# Altium schematic sheet WIFI.SchDoc
size A4
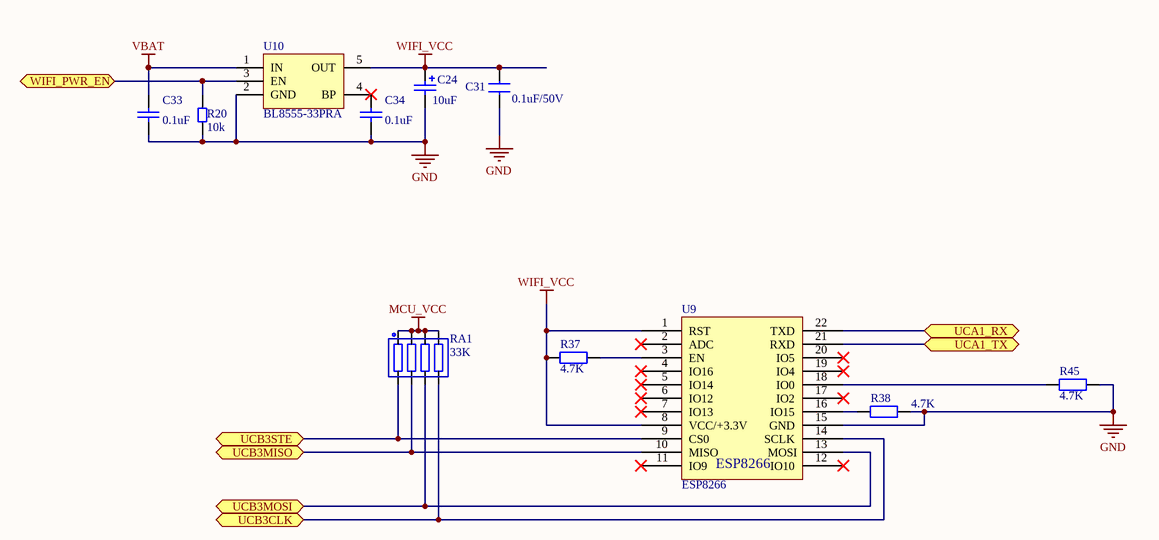
[diagram p0: WIFI.SchDoc]

## Parts
C24  10uF  [CAP1210]
C31  0.1uF/50V  [0603C]
C33  0.1uF  [0603C]
C34  0.1uF  [0603C]
R20  10k  [0603R]
R37  4.7K  [0603R]
R38  4.7K  [0603R]
R45  4.7K  [0603R]
RA1  33K  [RES_PACK_SMD_E]
U9  ESP8266  [ESP8266]
U10  BL8555-33PRA  [SOT23-5]

## Ports
UCA1_RX, UCA1_TX, UCB3CLK, UCB3MISO, UCB3MOSI, UCB3STE, WIFI_PWR_EN

## Nets
GND: C24.2 C31.2 C33.1 C34.1 R20.1 R38.2 R45.1 U9.15(GND) U10.2(GND)
MCU_VCC: RA1.1 RA1.2 RA1.3 RA1.4
VBAT: C33.2 U10.1(IN)
WIFI_VCC: C24.1 C31.1 R37.1 U9.1(RST) U9.8(VCC/+3.3V) U10.5(OUT)
UCA1_RX: U9.22(TXD) ; port UCA1_RX
UCA1_TX: U9.21(RXD) ; port UCA1_TX
UCB3CLK: RA1.5 U9.14(SCLK) ; port UCB3CLK
UCB3MISO: RA1.7 U9.10(MISO) ; port UCB3MISO
UCB3MOSI: RA1.6 U9.13(MOSI) ; port UCB3MOSI
UCB3STE: RA1.8 U9.9(CS0) ; port UCB3STE
WIFI_PWR_EN: R20.2 U10.3(EN) ; port WIFI_PWR_EN
NetC34_2: C34.2 U10.4(BP)
NetR37_2: R37.2 U9.3(EN)
NetR38_1: R38.1 U9.16(IO15)
NetR45_2: R45.2 U9.18(IO0)

Not connected (* = marked no-connect by the designer): U9 2(ADC)* 4(IO16)* 5(IO14)* 6(IO12)* 7(IO13)* 11(IO9)* 12(IO10)* 17(IO2)* 19(IO4)* 20(IO5)*

## Library data of the parts
C24 = Cap Pol: Polarized Capacitor (Radial); Published: 8-Jun-2000; LatestRevisionDate: 17-Jul-2002; LatestRevisionNote: Re-released for DXP Platform.; Publisher: Altium Limited; Value: 10uF
C31 = CAP
C33 C34 = Cap: Capacitor; Value: 104; Published: 8-Jun-2000; LatestRevisionDate: 17-Jul-2002; LatestRevisionNote: Re-released for DXP Platform.; Publisher: Altium Limited
R20 = Res2: Resistor; Value: 1K; Published: 8-Jun-2000; LatestRevisionDate: 17-Jul-2002; LatestRevisionNote: Re-released for DXP Platform.; Publisher: Altium Limited
R37 R38 R45 = 0603R
RA1 = RESPACK4
U10 = SGM2019